# Altium schematic sheet Sheet3.SchDoc
size A
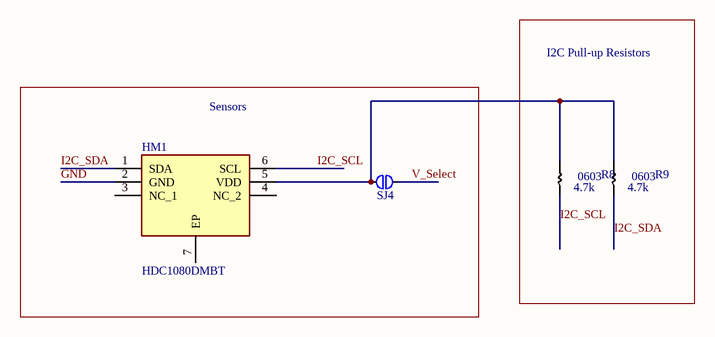
[diagram p0: Sheet3.SchDoc]

## Parts
HM1  HDC1080DMBT  [SON100P300X300X80-7N]
R8  4.7k  [0603_SMD]
R9  4.7k  [0603_SMD]
SJ4  Debug-Solder-Jumper  [DEBUG-SOLDER-JUMPER]  (value not drawn)  (no BOM)

## Blocks framed on the sheet
I2C Pull-up Resistors: R8 R9
Sensors: HM1 SJ4

## Nets
GND: HM1.2(GND)
I2C_SCL: HM1.6(SCL) R8.2
I2C_SDA: HM1.1(SDA) R9.2
V_Select: SJ4.2
NetHM1_5: HM1.5(VDD) R8.1 R9.1 SJ4.1

Not connected (* = marked no-connect by the designer): HM1 3(NC_1) 4(NC_2) 7(EP)

## Notes on the sheet
- (in symbol R_0603) 0603

## Library data of the parts
HM1 = HDC1080DMBT: Hygrometer; Manufacturer_Name: Texas Instruments; Datasheet Link: http://www.mouser.com/ds/2/405/hdc1080-844688.pdf; Height: 0.8mm; Manufacturer_Part_Number: HDC1080DMBT; Mouser Part Number: 595-HDC1080DMBT; Mouser Price/Stock: https://www.mouser.com/Search/Refine.aspx?Keyword=595-HDC1080DMBT; RS Part Number: 1330170P; RS Price/Stock: http://uk.rs-online.com/web/p/products/1330170P
R8 R9 = R_0603
SJ4 = Debug-Solder-Jumper: 3.5mm Diameter, Solder Jumper Pad; Category: Debug